# EAGLE design FTDI_GT16 (EAGLE 6.2)
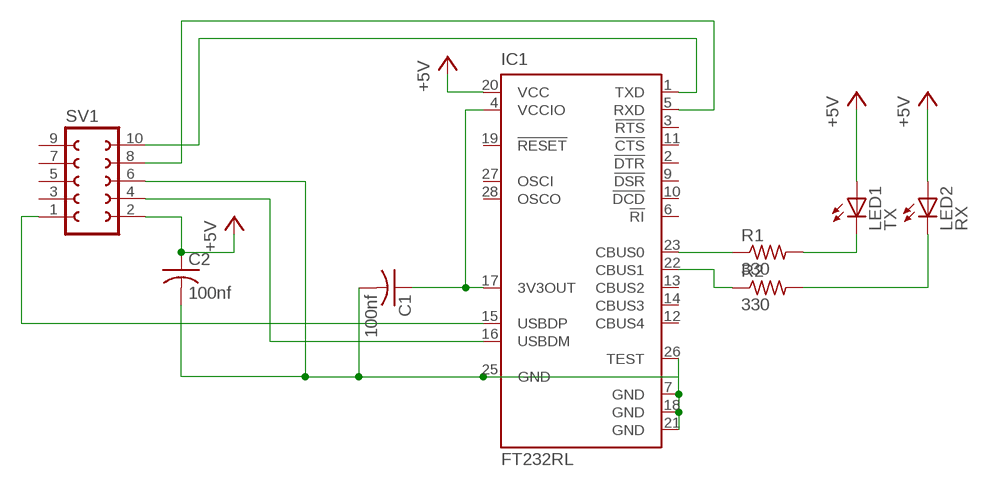
[diagram p0: schematic, sheet 1]

## Parts
C1  100nf  C-USC0805  [C0805]
C2  100nf  C-USC0805  [C0805]
IC1  FT232RL  [SSOP28]
LED1  TX  LEDCHIPLED_0805  [CHIPLED_0805]
LED2  RX  LEDCHIPLED_0805  [CHIPLED_0805]
R1  330  R-US_R0805  [R0805]
R2  330  R-US_R0805  [R0805]
SV1  FE05-2  [FE05-2]

## Nets
+5V: C2.1 IC1.20(VCC) LED1.A LED2.A SV1.2
N$2: C1.2 C2.2 IC1.7(GND) IC1.18(GND) IC1.21(GND) IC1.25(GND) IC1.26(TEST) SV1.6
N$3: IC1.15(USBDP) SV1.1
N$4: IC1.16(USBDM) SV1.4
N$5: C1.1 IC1.4(VCCIO) IC1.17(3V3OUT)
N$6: IC1.1(TXD) SV1.10
N$7: IC1.5(RXD) SV1.8
N$8: IC1.23(CBUS0) R1.1
N$9: LED1.C R1.2
N$10: LED2.C R2.2
N$11: IC1.22(CBUS1) R2.1
Unconnected: IC1.2(!DTR) IC1.3(!RTS) IC1.6(!RI) IC1.9(!DSR) IC1.10(!DCD) IC1.11(!CTS) IC1.12(CBUS4) IC1.13(CBUS2) IC1.14(CBUS3) IC1.19(!RESET) IC1.27(OSCI) IC1.28(OSCO) SV1.3 SV1.5 SV1.7 SV1.9

## Library data of the parts
C1 C2 = resistor:C-US: CAPACITOR, American symbol
IC1 = ftdichip:FT232R: Source: http://www.ftdichip.com/Documents/DataSheets/DS_FT232R_v104.pdf; MPN: FT232RL; OC_FARNELL: 1146032; OC_NEWARK: 91K9918
LED1 LED2 = led:LED: LED OSRAM: - CHIPLED LG R971, LG N971, LY N971, LG Q971, LY Q971, LO R971, LY R971 LH N974, LH R974 LS Q976, LO Q976, LY Q976 LO Q996 - Hyper CHIPLED LW Q18S LB Q993, LB Q99A, LB R99A - SideLED LS A670, LO A670, LY A670, LG A670, LP A670 LB A673, LV A673, LT A673, LW A673 LH A674 LY A675 LS A676, LA A676, LO A676, LY A676, LW A676 LS A679, LY A679, LG A679 - Hyper Micro SIDELED® LS Y876, LA Y876, LO Y876, LY Y876 LT Y87S - SmartLED LW L88C, LW L88S LB L89C, LB L89S, LG L890 LS L89K, LO L89K, LY L89K LS L896, LA L896, LO L896, LY L896 - TOPLED LS T670, LO T670, LY T670, LG T670, LP T670 LSG T670, LSP T670, LSY T670, LOP T670, LYG T670 LG T671, LOG T671, LSG T671 LB T673, LV T673, LT T673, LW T673 LH T674 LS T676, LA T676, LO T676, LY T676, LB T676, LH T676, LSB T676, LW T676 LB T67C, LV T67C, LT T67C, LS T67K, LO T67K, LY T67K, LW E67C LS E67B, LA E67B, LO E67B, LY E67B, LB E67C, LV E67C, LT E67C LW T67C LS T679, LY T679, LG T679 LS T770, LO T770, LY T770, LG T770, LP T770 LB T773, LV T773, LT T773, LW T773 LH T774 LS E675, LA E675, LY E675, LS T675 LS T776, LA T776, LO T776, LY T776, LB T776 LHGB T686 LT T68C, LB T68C - Hyper Mini TOPLED® LB M676 - Mini TOPLED Santana® LG M470 LS M47K, LO M47K, LY M47K Source: http://www.osram.convergy.de LUXEON: - LUMILED® LXK2-PW12-R00, LXK2-PW12-S00, LXK2-PW14-U00, LXK2-PW14-V00 LXK2-PM12-R00, LXK2-PM12-S00, LXK2-PM14-U00 LXK2-PE12-Q00, LXK2-PE12-R00, LXK2-PE12-S00, LXK2-PE14-T00, LXK2-PE14-U00 LXK2-PB12-K00, LXK2-PB12-L00, LXK2-PB12-M00, LXK2-PB14-N00, LXK2-PB14-P00, LXK2-PB14-Q00 LXK2-PR12-L00, LXK2-PR12-M00, LXK2-PR14-Q00, LXK2-PR14-R00 LXK2-PD12-Q00, LXK2-PD12-R00, LXK2-PD12-S00 LXK2-PH12-R00, LXK2-PH12-S00 LXK2-PL12-P00, LXK2-PL12-Q00, LXK2-PL12-R00 Source: www.luxeon.com KINGBRIGHT: KA-3528ASYC Source: www.kingbright.com
R1 R2 = resistor:R-US_: RESISTOR, American symbol
SV1 = con-lsta:FE05-2: FEMALE HEADER; OC_FARNELL: unknown; OC_NEWARK: unknown

## Board
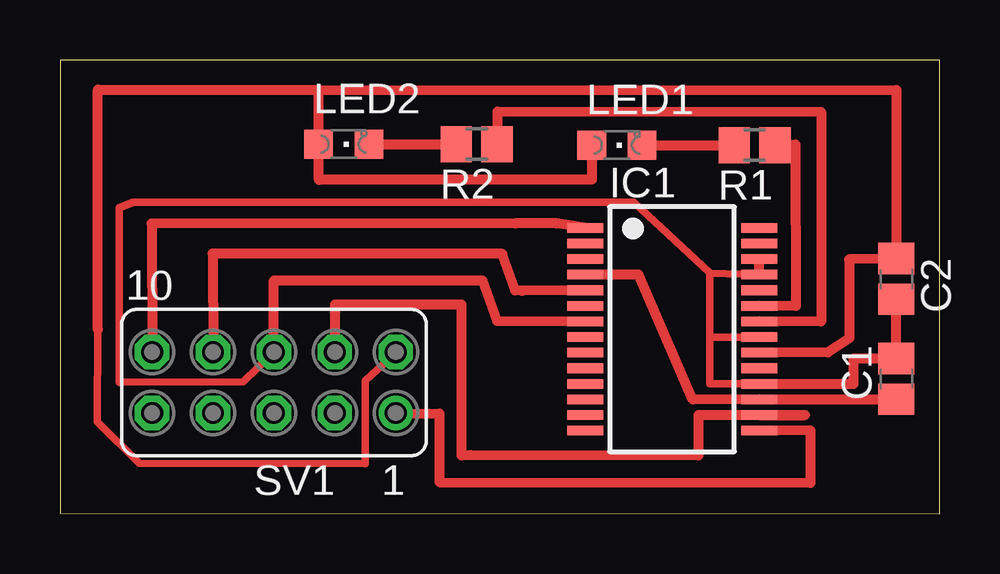
[diagram p1: board, top side]

Size 36.67 x 18.9 mm. Coordinates in mm from the lower left corner, seen from the top.
Outline: 0,0.01 36.65,0 36.66,18.89 0.01,18.9 0,0.01
Copper layers (1*16): Top 0.035mm / dielectric 1.5mm / Bottom 0.035mm
Design rules: minimum track width 10mil, minimum drill 24mil, track to track 8mil, track to pad 8mil, pad to pad 8mil, via to via 8mil, smd to smd 8mil, copper to edge 40mil, drill to drill 8mil, minimum pad ring 10mil, minimum via ring 8mil, stop-mask expansion 4mil, vias tented up to drill 0mil, thermal gap 10mil

### Footprints (pad centres in the part's own frame; a part is rotated, then mirrored left to right if it is on the bottom)
C0805 = smd 1.3 x 1.5: 1 -0.85,0; 2 0.85,0
SSOP28 = smd 0.4 x 1.5: 1 -4.225,-3.625; 2 -3.575,-3.625; 3 -2.925,-3.625; 4 -2.275,-3.625; 5 -1.625,-3.625; 6 -0.975,-3.625; 7 -0.325,-3.625; 8 0.325,-3.625; 9 0.975,-3.625; 10 1.625,-3.625; 11 2.275,-3.625; 12 2.925,-3.625; 13 3.575,-3.625; 14 4.225,-3.625; 15 4.225,3.625; 16 3.575,3.625; 17 2.925,3.625; 18 2.275,3.625; 19 1.625,3.625; 20 0.975,3.625; 21 0.325,3.625; 22 -0.325,3.625; 23 -0.975,3.625; 24 -1.625,3.625; 25 -2.275,3.625; 26 -2.925,3.625; 27 -3.575,3.625; 28 -4.225,3.625
CHIPLED_0805 = smd 1.2 x 1.2: A 0,-1.05; C 0,1.05
R0805 = smd 1.3 x 1.5: 1 -0.85,0; 2 0.85,0
FE05-2 = drill 0.914: 1 -5.08,1.27 | drill 0.914 octagon: 2 -5.08,-1.27; 3 -2.54,1.27; 4 -2.54,-1.27; 5 0,1.27; 6 0,-1.27; 7 2.54,1.27; 8 2.54,-1.27; 9 5.08,1.27; 10 5.08,-1.27

### Placement (x,y rotation side)
C1  34.85,5.61 90 top
C2  34.85,9.78 270 top
IC1  25.5,7.68 270 top
LED1  23.2,15.35 270 top
LED2  11.82,15.39 270 top
R1  28.94,15.35 180 top
R2  17.36,15.39 180 top
SV1  8.92,5.46 180 top

### Tracks (layer width: path | path; a pad name or v marks a point on that pad's centre or on a via)
+5V
  Top 0.305: SV1.2 13.98,6.71 12.72,5.54 12.71,2.08 3.3,2.1 1.55,3.84 1.57,7.67
  Top 0.406: 1.57,7.67 1.57,17.67 10.78,17.67 | 10.78,17.67 34.85,17.64 C2.1 32.88,10.59 32.89,7.32 31.99,6.72 IC1.20 | LED1.A 22.16,13.92 10.78,13.91 | 10.78,13.91 LED2.A | 10.78,13.91 10.78,17.67
N$2
  Top 0.305: IC1.18 27.06,5.41 27.06,7.35 | 27.06,7.35 IC1.21 | IC1.25 27.06,10.01 | 27.06,10.01 27.06,7.35 | 27.06,10.01 27.06,10.05 23.9,12.97 3.06,12.98 2.48,12.75 2.46,8.13 2.48,5.47 7.63,5.49 SV1.6
  Top 0.406: IC1.25 IC1.26 | IC1.18 33.07,5.41 33.07,6.46 C1.2 C2.2 | SV1.6 8.91,9.72 17.6,9.72 18.2,8.03 IC1.7
N$3
  Top 0.406: SV1.1 15.81,4.17 15.81,1.31 31.28,1.28 31.28,3.47 IC1.15
N$4
  Top 0.406: IC1.16 31.04,4.1 26.59,4.1 26.59,2.41 17.11,2.44 16.74,2.41 16.74,8.71 11.46,8.71 SV1.4
N$5
  Top 0.406: C1.1 IC1.17 26.36,4.75 24.11,9.96 IC1.4
N$6
  Top 0.406: IC1.1 20.69,12.09 18.97,12.09 3.82,12.08 SV1.10
N$7
  Top 0.406: IC1.5 19.25,9.28 18.96,9.3 18.43,10.82 6.36,10.83 SV1.8
N$8
  Top 0.406: R1.1 30.64,15.38 30.66,8.65 IC1.23
N$9
  Top 0.406: LED1.C R1.2
N$10
  Top 0.406: LED2.C R2.2
N$11
  Top 0.406: R2.1 18.24,16.76 31.71,16.74 31.71,8 IC1.22